# EAGLE design atxmega128d3_breakout (EAGLE 6.1)
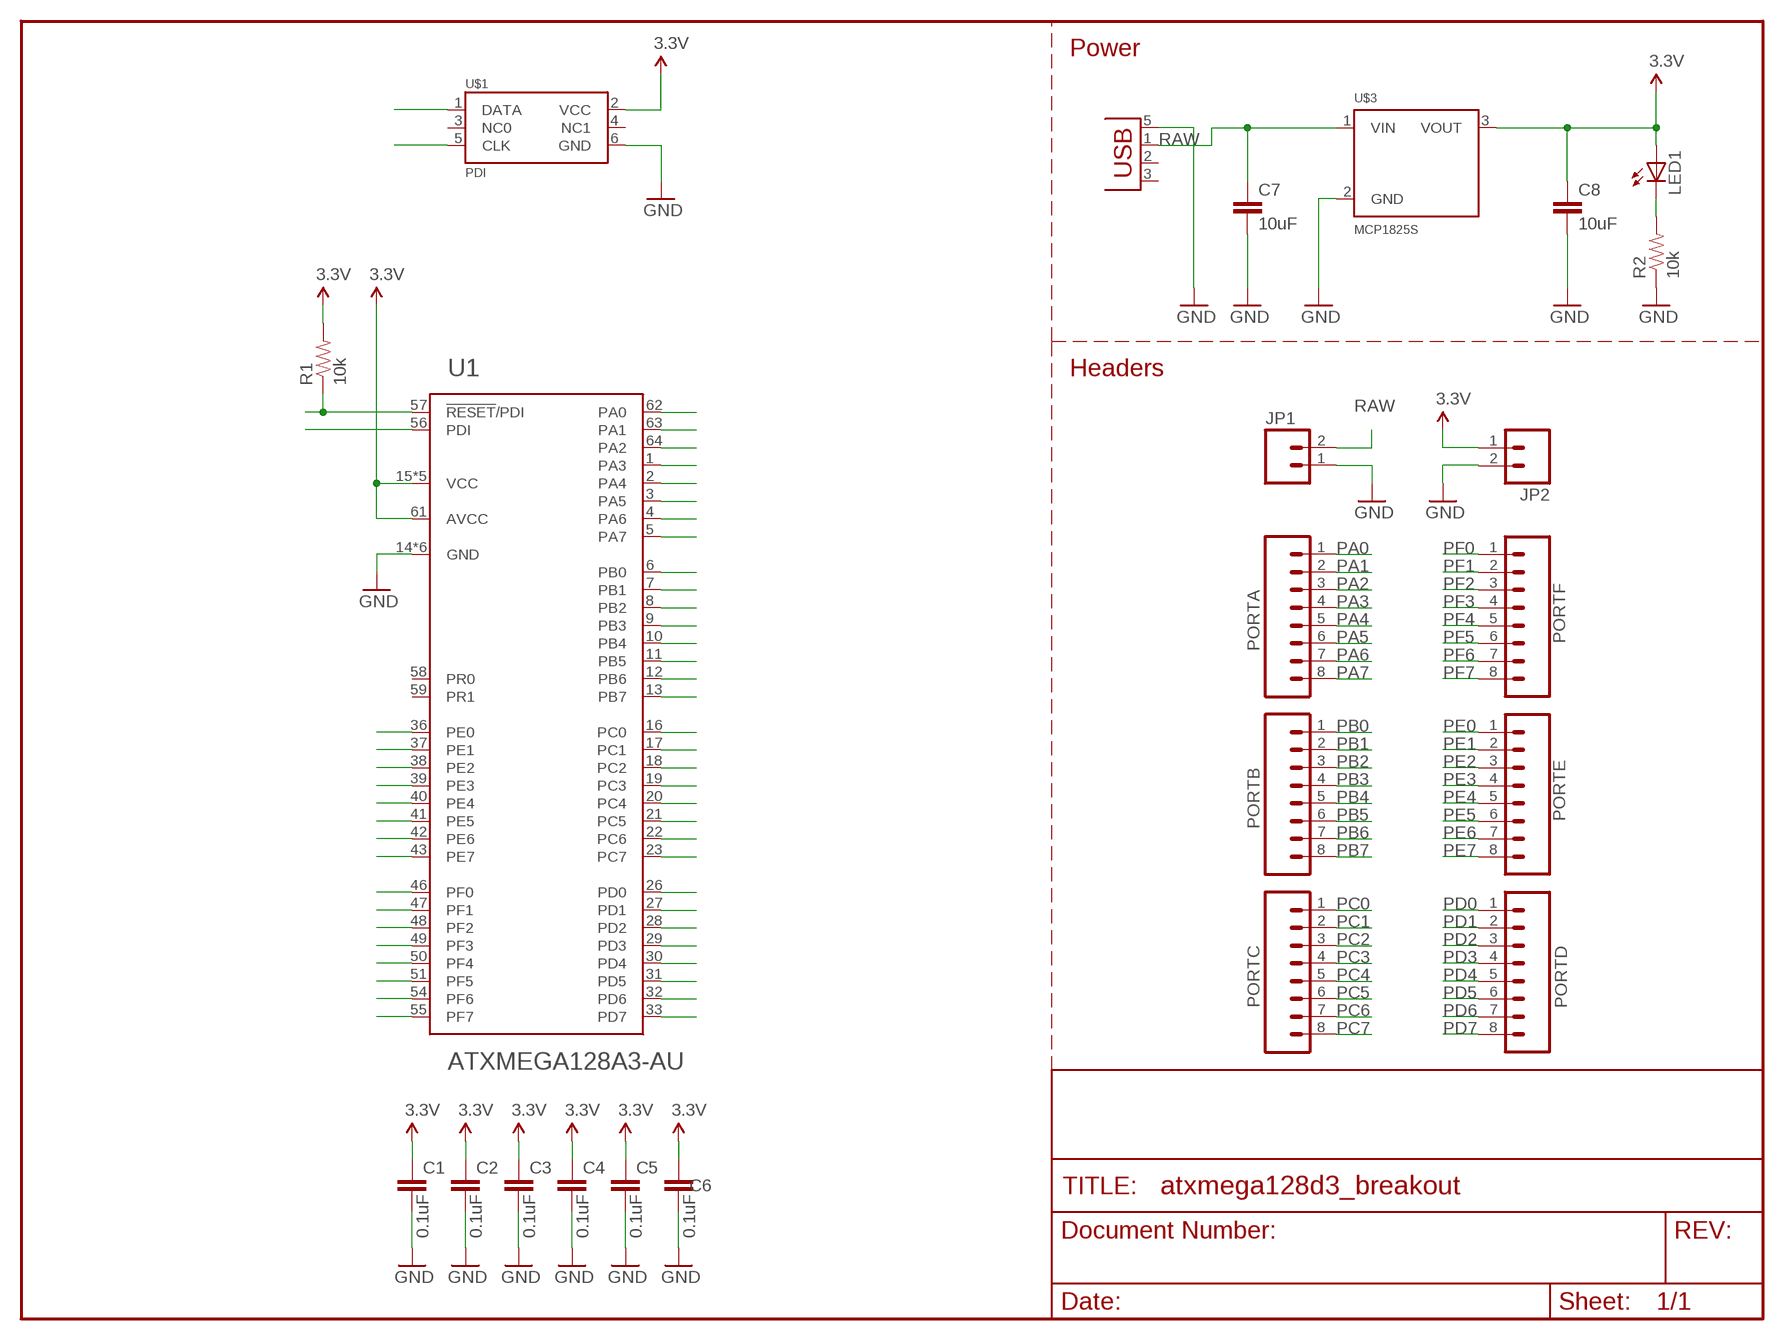
[diagram p0: schematic, sheet 1]

## Parts
C1  0.1uF  CAP0805  [0805]
C2  0.1uF  CAP0805  [0805]
C3  0.1uF  CAP0805  [0805]
C4  0.1uF  CAP0805  [0805]
C5  0.1uF  CAP0805  [0805]
C6  0.1uF  CAP0805  [0805]
C7  10uF  CAP0805  [0805]
C8  10uF  CAP0805  [0805]
JP1  M02PTH  [1X02]
JP2  M02PTH  [1X02]
LED1  LEDCHIP-LED0805  [CHIP-LED0805]
PORTA  M081X08  [1X08]
PORTB  M081X08  [1X08]
PORTC  M081X08  [1X08]
PORTD  M081X08  [1X08]
PORTE  M081X08  [1X08]
PORTF  M081X08  [1X08]
R1  10k  RESISTOR0805-RES  [0805]
R2  10k  RESISTOR0805-RES  [0805]
U1  ATXMEGA128A3-AU  [TQFP-64A-64]
U$1  PDI  [2X3]
U$2  USB  [USB_MICRO_B]
U$3  MCP1825S  [SOT233]

## Nets
3.3V: C1.1 C2.1 C3.1 C4.1 C5.1 C6.1 C8.1 JP2.1 LED1.A R1.2 U1.15(VCC) U1.25(VCC) U1.35(VCC) U1.45(VCC) U1.53(VCC) U1.61(AVCC) U$1.2(VCC) U$3.3(VOUT)
CLK: R1.1 U1.57(!RESET!/PDI) U$1.5(CLK)
DATA: U1.56(PDI) U$1.1(DATA)
GND: C1.2 C2.2 C3.2 C4.2 C5.2 C6.2 C7.2 C8.2 JP1.1 JP2.2 R2.1 U1.14(GND) U1.24(GND) U1.34(GND) U1.44(GND) U1.52(GND) U1.60(GND) U$1.6(GND) U$2.5(GND) U$3.2(GND)
N$1: LED1.C R2.2
PA0: PORTA.1 U1.62(PA0)
PA1: PORTA.2 U1.63(PA1)
PA2: PORTA.3 U1.64(PA2)
PA3: PORTA.4 U1.1(PA3)
PA4: PORTA.5 U1.2(PA4)
PA5: PORTA.6 U1.3(PA5)
PA6: PORTA.7 U1.4(PA6)
PA7: PORTA.8 U1.5(PA7)
PB0: PORTB.1 U1.6(PB0)
PB1: PORTB.2 U1.7(PB1)
PB2: PORTB.3 U1.8(PB2)
PB3: PORTB.4 U1.9(PB3)
PB4: PORTB.5 U1.10(PB4)
PB5: PORTB.6 U1.11(PB5)
PB6: PORTB.7 U1.12(PB6)
PB7: PORTB.8 U1.13(PB7)
PC0: PORTC.1 U1.16(PC0)
PC1: PORTC.2 U1.17(PC1)
PC2: PORTC.3 U1.18(PC2)
PC3: PORTC.4 U1.19(PC3)
PC4: PORTC.5 U1.20(PC4)
PC5: PORTC.6 U1.21(PC5)
PC6: PORTC.7 U1.22(PC6)
PC7: PORTC.8 U1.23(PC7)
PD0: PORTD.1 U1.26(PD0)
PD1: PORTD.2 U1.27(PD1)
PD2: PORTD.3 U1.28(PD2)
PD3: PORTD.4 U1.29(PD3)
PD4: PORTD.5 U1.30(PD4)
PD5: PORTD.6 U1.31(PD5)
PD6: PORTD.7 U1.32(PD6)
PD7: PORTD.8 U1.33(PD7)
PE0: PORTE.1 U1.36(PE0)
PE1: PORTE.2 U1.37(PE1)
PE2: PORTE.3 U1.38(PE2)
PE3: PORTE.4 U1.39(PE3)
PE4: PORTE.5 U1.40(PE4)
PE5: PORTE.6 U1.41(PE5)
PE6: PORTE.7 U1.42(PE6)
PE7: PORTE.8 U1.43(PE7)
PF0: PORTF.1 U1.46(PF0)
PF1: PORTF.2 U1.47(PF1)
PF2: PORTF.3 U1.48(PF2)
PF3: PORTF.4 U1.49(PF3)
PF4: PORTF.5 U1.50(PF4)
PF5: PORTF.6 U1.51(PF5)
PF6: PORTF.7 U1.54(PF6)
PF7: PORTF.8 U1.55(PF7)
RAW: C7.1 JP1.2 U$2.1(VBUS) U$3.1(VIN)
Unconnected: U1.58(PR0) U1.59(PR1) U$1.3(NC0) U$1.4(NC1) U$2.2(D-) U$2.3(D+)

## Notes on the sheet
- Power
- Headers

## Library data of the parts
C1-C8 = SparkFun:CAP: Capacitor Standard 0603 ceramic capacitor, and 0.1" leaded capacitor.
JP1 JP2 = SparkFun:M02: Header 2 Standard 2-pin 0.1" header. Use with straight break away headers (SKU : PRT-00116), right angle break away headers (PRT-00553), swiss pins (PRT-00743), machine pins (PRT-00117), and female headers (PRT-00115). Molex polarized connector foot print use with SKU : PRT-08233 with associated crimp pins and housings.
LED1 = led:LED: LED OSRAM: - CHIPLED LG R971, LG N971, LY N971, LG Q971, LY Q971, LO R971, LY R971 LH N974, LH R974 LS Q976, LO Q976, LY Q976 LO Q996 - Hyper CHIPLED LW Q18S LB Q993, LB Q99A, LB R99A - SideLED LS A670, LO A670, LY A670, LG A670, LP A670 LB A673, LV A673, LT A673, LW A673 LH A674 LY A675 LS A676, LA A676, LO A676, LY A676, LW A676 LS A679, LY A679, LG A679 - Hyper Micro SIDELED® LS Y876, LA Y876, LO Y876, LY Y876 LT Y87S - SmartLED LW L88C, LW L88S LB L89C, LB L89S, LG L890 LS L89K, LO L89K, LY L89K LS L896, LA L896, LO L896, LY L896 - TOPLED LS T670, LO T670, LY T670, LG T670, LP T670 LSG T670, LSP T670, LSY T670, LOP T670, LYG T670 LG T671, LOG T671, LSG T671 LB T673, LV T673, LT T673, LW T673 LH T674 LS T676, LA T676, LO T676, LY T676, LB T676, LH T676, LSB T676, LW T676 LB T67C, LV T67C, LT T67C, LS T67K, LO T67K, LY T67K, LW E67C LS E67B, LA E67B, LO E67B, LY E67B, LB E67C, LV E67C, LT E67C LW T67C LS T679, LY T679, LG T679 LS T770, LO T770, LY T770, LG T770, LP T770 LB T773, LV T773, LT T773, LW T773 LH T774 LS E675, LA E675, LY E675, LS T675 LS T776, LA T776, LO T776, LY T776, LB T776 LHGB T686 LT T68C, LB T68C - Hyper Mini TOPLED® LB M676 - Mini TOPLED Santana® LG M470 LS M47K, LO M47K, LY M47K Source: http://www.osram.convergy.de LUXEON: - LUMILED® LXK2-PW12-R00, LXK2-PW12-S00, LXK2-PW14-U00, LXK2-PW14-V00 LXK2-PM12-R00, LXK2-PM12-S00, LXK2-PM14-U00 LXK2-PE12-Q00, LXK2-PE12-R00, LXK2-PE12-S00, LXK2-PE14-T00, LXK2-PE14-U00 LXK2-PB12-K00, LXK2-PB12-L00, LXK2-PB12-M00, LXK2-PB14-N00, LXK2-PB14-P00, LXK2-PB14-Q00 LXK2-PR12-L00, LXK2-PR12-M00, LXK2-PR14-Q00, LXK2-PR14-R00 LXK2-PD12-Q00, LXK2-PD12-R00, LXK2-PD12-S00 LXK2-PH12-R00, LXK2-PH12-S00 LXK2-PL12-P00, LXK2-PL12-Q00, LXK2-PL12-R00 Source: www.luxeon.com KINGBRIGHT: KA-3528ASYC Source: www.kingbright.com
PORTA PORTB PORTC PORTD PORTE PORTF = SparkFun:M08: Header 8 Standard 8-pin 0.1" header. Use with straight break away headers (SKU : PRT-00116), right angle break away headers (PRT-00553), swiss pins (PRT-00743), machine pins (PRT-00117), and female headers (PRT-00115).
R1 R2 = SparkFun:RESISTOR: Resistor Basic schematic elements and footprints for 0603, 1206, and PTH resistors.
U1 = atmel-xmega:ATXMEGA128A3: 8/16-bit XMEGA A3 Microcontroller Features High-performance, Low-power 8/16-bit Atmel® AVR® XMEGATM Microcontroller Non-volatile Program and Data Memories – 64 KB - 256 KB of In-System Self-Programmable Flash – 4 KB - 8 KB Boot Code Section with Independent Lock Bits – 2 KB - 4 KB EEPROM – 4 KB - 16 KB Internal SRAM Peripheral Features – Four-channel DMA Controller with support for external requests – Eight-channel Event System – Seven 16-bit Timer/Counters Four Timer/Counters with 4 Output Compare or Input Capture channels Three Timer/Counters with 2 Output Compare or Input Capture channels High Resolution Extensions on all Timer/Counters Advanced Waveform Extension on one Timer/Counter – Seven USARTs IrDA Extension on 1 USART – AES and DES Crypto Engine – Two Two-wire Interfaces with dual address match (I2C and SMBus compatible) – Three SPI (Serial Peripheral Interfaces) – 16-bit Real Time Counter with Separate Oscillator – Two Eight-channel, 12-bit, 2 Msps Analog to Digital Converters – One Two-channel, 12-bit, 1 Msps Digital to Analog Converter – Four Analog Comparators with Window compare function – External Interrupts on all General Purpose I/O pins – Programmable Watchdog Timer with Separate On-chip Ultra Low Power Oscillator Special Microcontroller Features – Power-on Reset and Programmable Brown-out Detection – Internal and External Clock Options with PLL – Programmable Multi-level Interrupt Controller – Sleep Modes: Idle, Power-down, Standby, Power-save, Extended Standby – Advanced Programming, Test and Debugging Interfaces JTAG (IEEE 1149.1 Compliant) Interface for test, debug and programming PDI (Program and Debug Interface) for programming, test and debugging I/O and Packages – 50 Programmable I/O Lines – 64-lead TQFP – 64-pad QFN Operating Voltage – 1.6 – 3.6V Speed performance – 0 – 12 MHz @ 1.6 – 3.6V – 0 – 32 MHz @ 2.7 – 3.6V
U$1 = rocket:PDI
U$2 = rocket:USB
U$3 = rocket:MCP1825S

## Board
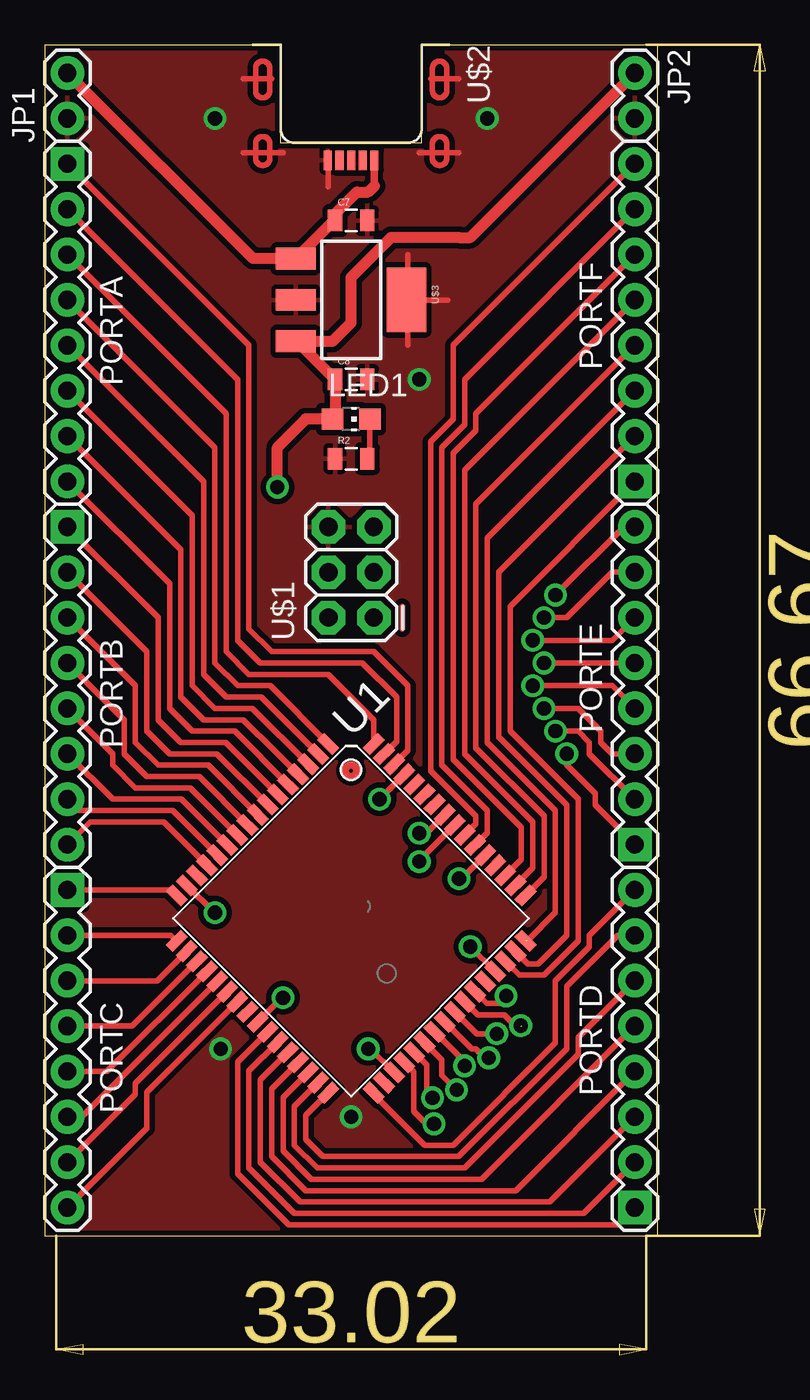
[diagram p1: board, top side]
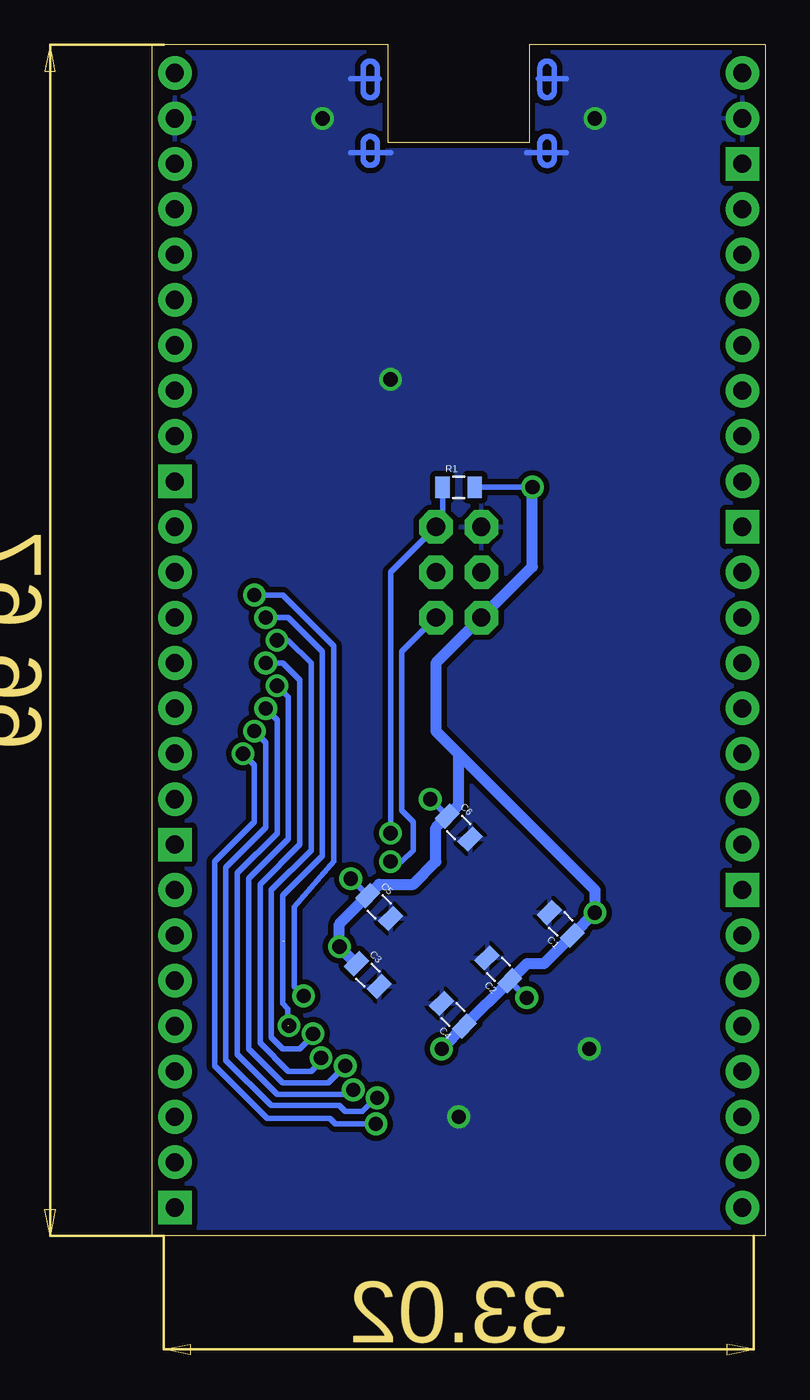
[diagram p2: board, bottom side, seen from below]

Size 34.29 x 66.67 mm. Coordinates in mm from the lower left corner, seen from the top.
Outline: 0,0 34.29,0 34.29,66.67 21.09,66.67 21.09,61.19 13.18,61.19 13.18,66.67 0,66.67 0,0
Copper layers (1*16): Top 0.035mm / dielectric 1.5mm / Bottom 0.035mm
Design rules "default": minimum track width 10mil, minimum drill 24mil, track to track 8mil, track to pad 8mil, pad to pad 8mil, via to via 8mil, smd to smd 8mil, copper to edge 8mil, drill to drill 8mil, minimum pad ring 10mil, minimum via ring 8mil, stop-mask expansion 4mil, vias tented up to drill 0mil, thermal gap 10mil
tRestrict: area 16.5,45.1 to 17.8,46.4

### Footprints (pad centres in the part's own frame; a part is rotated, then mirrored left to right if it is on the bottom)
0805 = smd 0.8 x 1.2: 1 -0.9,0; 2 0.9,0
1X02 = drill 1.016 pad 1.88: 1 0,0; 2 2.54,0
CHIP-LED0805 = smd 1.2 x 1.2: A 0,-1.05; C 0,1.05
1X08 = drill 1.016 pad 1.88 square: 1 0,0 | drill 1.016 pad 1.88: 2 2.54,0; 3 5.08,0; 4 7.62,0; 5 10.16,0; 6 12.7,0; 7 15.24,0; 8 17.78,0
TQFP-64A-64 = smd 1.194 x 0.559: 1 -7.8,6; 2 -7.8,5.2; 3 -7.8,4.4; 4 -7.8,3.6; 5 -7.8,2.8; 6 -7.8,2; 7 -7.8,1.2; 8 -7.8,0.4; 9 -7.8,-0.4; 10 -7.8,-1.2; 11 -7.8,-2; 12 -7.8,-2.8; 13 -7.8,-3.6; 14 -7.8,-4.4; 15 -7.8,-5.2; 16 -7.8,-6; 33 7.8,-6; 34 7.8,-5.2; 35 7.8,-4.4; 36 7.8,-3.6; 37 7.8,-2.8; 38 7.8,-2; 39 7.8,-1.2; 40 7.8,-0.4; 41 7.8,0.4; 42 7.8,1.2; 43 7.8,2; 44 7.8,2.8; 45 7.8,3.6; 46 7.8,4.4; 47 7.8,5.2; 48 7.8,6 | smd 0.559 x 1.194: 17 -6,-7.8; 18 -5.2,-7.8; 19 -4.4,-7.8; 20 -3.6,-7.8; 21 -2.8,-7.8; 22 -2,-7.8; 23 -1.2,-7.8; 24 -0.4,-7.8; 25 0.4,-7.8; 26 1.2,-7.8; 27 2,-7.8; 28 2.8,-7.8; 29 3.6,-7.8; 30 4.4,-7.8; 31 5.2,-7.8; 32 6,-7.8; 49 6,7.8; 50 5.2,7.8; 51 4.4,7.8; 52 3.6,7.8; 53 2.8,7.8; 54 2,7.8; 55 1.2,7.8; 56 0.4,7.8; 57 -0.4,7.8; 58 -1.2,7.8; 59 -2,7.8; 60 -2.8,7.8; 61 -3.6,7.8; 62 -4.4,7.8; 63 -5.2,7.8; 64 -6,7.8
2X3 = drill 1.016 pad 1.88 octagon: 1 -2.54,-1.27; 2 -2.54,1.27; 3 0,-1.27; 4 0,1.27; 5 2.54,-1.27; 6 2.54,1.27
USB_MICRO_B = smd 1.1 x 0.45: 1 6.47,1.3; 2 6.47,0.65; 3 6.47,0; 4 6.47,-0.65; 5 6.47,-1.3
SOT233 = smd 1.219 x 2.235: 1 -2.311,-3.099; 2 0,-3.099; 3 2.311,-3.099 | smd 3.6 x 2.2: 4 0,3.099

### Placement (x,y rotation side)
C1  11.43,17.46 135 bottom
C2  14.92,14.92 135 bottom
C3  22.23,14.61 315 bottom
C4  17.46,12.38 135 bottom
C5  21.59,18.41 315 bottom
C6  17.14,22.86 315 bottom
C7  17.14,56.83 0 top
C8  17.14,47.94 0 top
JP1  1.27,62.55 90 top
JP2  33.02,65.09 270 top
LED1  17.14,45.72 270 top
PORTA  1.27,60.01 270 top
PORTB  1.27,39.69 270 top
PORTC  1.27,19.37 270 top
PORTD  33.02,1.59 90 top
PORTE  33.02,21.91 90 top
PORTF  33.02,42.23 90 top
R1  17.14,41.91 0 bottom
R2  17.14,43.5 0 top
U1  17.14,17.78 315 top
U$1  17.14,37.15 90 top
U$2  17.14,66.67 270 top
U$3  17.14,52.39 270 top

### Tracks (layer width: path | path; a pad name or v marks a point on that pad's centre or on a via)
3.3V  (via drill 0.79 pad 1.27)
  Top 0.305: U1.61 v18.73,24.45 | v23.18,20 23.33,20 U1.53 | U1.45 25.2,14.81 v23.81,16.19 | v18.1,10.48 18.23,10.48 U1.35 | v13.34,13.34 13.27,13.34 U1.25 | v9.53,18.1 9.47,18.1 U1.15
  Top 0.61: 14.11,50.08 C8.1 16.25,45.87 LED1.A 14.61,45.72 13.02,44.13 v13.02,41.91 | 14.11,50.08 U$3.3 | 14.11,50.08 16.1,50.08 17.14,51.12 17.14,53.66 19.37,55.88 23.18,55.88 23.81,55.88 JP2.1
  Bottom 0.305: C1.1 | C2.1 v13.34,13.34 | v13.34,13.34 | v18.09,10.48 v18.1,10.48 | C5.1 v23.18,20 | R1.2 v13.02,41.91 | C6.1 v18.73,24.45
  Bottom 0.61: 17.14,26.99 18.41,28.26 18.41,32.07 U$1.2 13.02,37.47 v13.02,41.91 | 17.14,26.99 9.53,19.37 v9.53,18.1 C1.1 | 17.14,26.99 17.14,24.13 C6.1 18.41,22.86 18.41,20.95 19.68,19.68 21.59,19.68 C5.1 23.81,17.46 v23.81,16.19 C3.1 | C1.1 12.38,15.24 13.34,15.24 C2.1 | C2.1 C4.1 v18.09,10.48
CLK  (via drill 0.79 pad 1.27)
  Top 0.305: U1.57 21.34,22.54 v20.95,22.54
  Bottom 0.305: v20.95,22.54 20.95,37.15 U$1.5 18.05,40.06 R1.1
DATA  (via drill 0.79 pad 1.27)
  Top 0.305: v20.95,20.95 20.95,21.02 U1.56
  Bottom 0.305: U$1.1 20.32,32.7 20.32,23.81 19.68,23.18 19.68,21.59 20.32,20.95 v20.95,20.95
GND  (via drill 0.79 pad 1.27)
  Top 0.305: 11.11,64.77 12.7,64.77 | 11.11,60.64 13.34,60.64 | 20.95,60.64 23.18,60.64 | 21.59,64.77 23.18,64.77 | 15.88,60.64 15.88,58.74 | 20.32,52.39 22.54,52.39 | 20.32,49.85 20.32,54.93
  Bottom 0.305: 11.11,64.77 12.7,64.77 | 11.11,60.64 13.34,60.64 | 20.95,60.64 23.18,60.64 | 21.59,64.77 23.18,64.77
  other vias: 20.95,47.94 24.77,62.55 9.53,62.55 17.14,6.67 9.84,10.48
  pour Bottom (isolate 0.305): 0,0 34.29,0 34.29,66.67 0,66.67
  pour Top (isolate 0.305): 0,0 34.29,0 34.29,66.67 0,66.67
N$1
  Top 0.305: LED1.C 18.2,43.65 R2.2
N$2
  Top 0.305: 20,35.24 20,33.97
PA0
  Top 0.305: PORTA.1 11.43,49.85 11.43,33.97 12.7,32.7 18.41,32.7 20.32,30.8 20.32,27.18 U1.62
PA1
  Top 0.305: PORTA.2 10.79,47.94 10.79,33.34 12.06,32.07 17.78,32.07 19.68,30.16 19.68,27.67 U1.63
PA2
  Top 0.305: PORTA.3 10.16,46.04 10.16,32.7 11.43,31.43 15.88,31.43 18.42,28.89 U1.64
PA3
  Top 0.305: PORTA.4 9.53,44.13 9.53,32.07 10.79,30.8 12.61,30.8 U1.1
PA4
  Top 0.305: PORTA.5 8.89,42.23 8.89,31.43 10.16,30.16 12.12,30.16 U1.2
PA5
  Top 0.305: PORTA.6 8.26,40.32 8.26,30.8 9.53,29.53 11.62,29.53 U1.3
PA6
  Top 0.305: U1.4 12.89,27.11 11.11,28.89 8.89,28.89 7.62,30.16 7.62,38.42 PORTA.7
PA7
  Top 0.305: PORTA.8 6.99,36.51 6.99,29.53 8.26,28.26 10.63,28.26 U1.5
PB0
  Top 0.305: PORTB.1 6.35,34.61 6.35,28.89 7.62,27.62 10.13,27.62 U1.6
PB1
  Top 0.305: U1.7 9.63,26.99 6.99,26.99 5.71,28.26 5.71,32.7 PORTB.2
PB2
  Top 0.305: U1.8 9.14,26.35 6.35,26.35 5.08,27.62 5.08,30.8 PORTB.3
PB3
  Top 0.305: U1.9 8.64,25.72 5.71,25.72 4.45,26.99 4.45,28.89 PORTB.4
PB4
  Top 0.305: U1.10 8.14,25.08 5.08,25.08 3.81,26.35 3.81,26.99 PORTB.5
PB5
  Top 0.305: U1.11 7.65,24.45 3.81,24.45 PORTB.6
PB6
  Top 0.305: U1.12 7.15,23.81 1.91,23.81 PORTB.7
PB7
  Top 0.305: U1.13 6.66,23.18 2.54,23.18 PORTB.8
PC0
  Top 0.305: PORTC.1 7.07,19.37 U1.16
PC1
  Top 0.305: PORTC.2 7.07,16.83 U1.17
PC2
  Top 0.305: PORTC.3 6.3,14.29 U1.18
PC3
  Top 0.305: U1.19 4.89,11.75 PORTC.4
PC4
  Top 0.305: U1.20 3.48,9.21 PORTC.5
PC5
  Top 0.305: U1.21 2.07,6.67 PORTC.6
PC6
  Top 0.305: U1.22 5.08,8.54 5.08,7.94 PORTC.7
PC7
  Top 0.305: U1.23 5.71,8.05 5.71,6.03 PORTC.8
PD0
  Top 0.305: U1.26 10.79,9.73 10.79,3.49 13.65,0.64 32.07,0.64 PORTD.1
PD1
  Top 0.305: U1.27 11.43,9.24 11.43,3.81 13.97,1.27 30.16,1.27 PORTD.2
PD2
  Top 0.305: U1.28 12.06,8.74 12.06,4.13 14.29,1.91 28.26,1.91 PORTD.3
PD3
  Top 0.305: U1.29 12.7,8.24 12.7,4.45 14.61,2.54 26.35,2.54 PORTD.4
PD4
  Top 0.305: U1.30 13.34,7.75 13.34,4.76 14.92,3.17 24.45,3.17 PORTD.5
PD5
  Top 0.305: U1.31 13.97,7.25 13.97,5.08 15.24,3.81 23.5,3.81 29.84,10.16 29.84,11.11 PORTD.6
PD6
  Top 0.305: U1.32 14.61,6.75 14.61,5.4 15.56,4.45 23.18,4.45 29.21,10.48 29.21,13.97 32.07,16.83 PORTD.7
PD7
  Top 0.305: PORTD.8 30.48,16.83 30.48,16.19 28.57,14.29 28.57,10.79 22.86,5.08 21.27,5.08 18.42,7.93 U1.33
PE0  (via drill 0.79 pad 1.27)
  Top 0.305: PORTE.1 30.8,24.13 30.8,24.77 29.21,26.35 v29.21,26.99 | U1.36 20.64,9.2 20.64,6.99 21.35,6.27 v21.78,6.27
  Bottom 0.305: v29.21,26.99 28.57,26.35 28.57,23.18 30.8,20.95 30.8,9.53 27.86,6.59 24.37,6.59 24.05,6.27 v21.78,6.27
PE1  (via drill 0.79 pad 1.27)
  Top 0.305: PORTE.2 30.48,26.99 30.48,27.62 29.84,28.26 v28.57,28.26 | U1.37 21.38,9.58 21.38,8.05 v21.7,7.73
  Bottom 0.305: v21.7,7.73 21.8,7.73 22.54,6.99 23.5,6.99 23.81,7.3 27.62,7.3 30.16,9.84 30.16,20.64 27.94,22.86 27.94,27.62 v28.57,28.26
PE2  (via drill 0.79 pad 1.27)
  Top 0.305: PORTE.3 31.75,26.99 31.11,27.62 31.11,28.26 29.84,29.53 v27.94,29.53 | U1.38 22.23,9.87 22.23,9 v23.05,8.18
  Bottom 0.305: v27.94,29.53 27.3,28.89 27.3,22.54 29.53,20.32 29.53,10.16 27.3,7.94 23.29,7.94 v23.05,8.18
PE3  (via drill 0.79 pad 1.27)
  Top 0.305: PORTE.4 31.75,30.8 v27.3,30.8 | v23.5,9.53 23.5,9.73 U1.39
  Bottom 0.305: v23.5,9.53 24.45,8.57 26.99,8.57 28.89,10.48 28.89,20 26.67,22.23 26.67,30.16 v27.3,30.8
PE4  (via drill 0.79 pad 1.27)
  Top 0.305: U1.40 23.88,10.48 24.13,10.48 24.63,9.97 v24.84,9.97 | v27.94,32.07 PORTE.5
  Bottom 0.305: v24.84,9.97 24.84,9.77 25.4,9.21 26.67,9.21 28.26,10.79 28.26,19.68 26.04,21.91 26.04,31.11 26.99,32.07 v27.94,32.07
PE5  (via drill 0.79 pad 1.27)
  Top 0.305: v27.3,33.34 31.75,33.34 PORTE.6 | U1.41 24.17,11.32 v25.29,11.32
  Bottom 0.305: v25.29,11.32 25.29,11.22 26.04,10.48 26.99,10.48 27.62,11.11 27.62,19.37 25.4,21.59 25.4,32.07 26.67,33.34 v27.3,33.34
PE6  (via drill 0.79 pad 1.27)  (1 unrouted)
  Top 0.305: PORTE.7 31.75,37.15 29.21,34.61 v27.94,34.61 | U1.42 24.24,12.38 25.72,12.38 26.33,11.77 v26.64,11.77
  Bottom 0.305: v27.94,34.61 26.67,34.61 24.77,32.7 24.77,21.27 26.99,19.05 26.99,13.02 26.69,12.72 26.69,11.77
PE7  (via drill 0.79 pad 1.27)
  Top 0.305: U1.43 24.74,13.02 25.4,13.02 v25.82,13.44 | PORTE.8 32.38,39.69 v28.57,35.88
  Bottom 0.305: v28.57,35.88 26.99,35.88 24.13,33.02 24.13,20.95 26.35,18.41 26.35,13.97 v25.82,13.44
PF0
  Top 0.305: PORTF.1 26.04,35.24 26.04,28.26 29.84,24.45 29.84,16.51 27.94,14.61 26.54,14.61 U1.46
PF1
  Top 0.305: PORTF.2 25.4,37.15 25.4,27.94 29.21,24.13 29.21,16.83 27.62,15.24 27.04,15.24 U1.47
PF2  (1 unrouted)
  Top 0.305: PORTF.3 24.77,39.05 24.77,27.62 28.57,23.81 28.57,18.1 26.99,16.51
PF3
  Top 0.305: PORTF.4 24.13,40.96 24.13,27.3 27.94,23.5 27.94,20.09 U1.49
PF4
  Top 0.305: PORTF.5 23.5,42.86 23.5,26.99 27.3,23.18 27.3,20.59 U1.50
PF5
  Top 0.305: PORTF.6 24.13,46.04 24.13,45.09 22.86,43.81 22.86,26.67 26.67,22.86 26.67,21.08 U1.51
PF6
  Top 0.305: PORTF.7 23.5,47.94 23.5,45.4 22.23,44.13 22.23,26.35 24.77,23.81 24.77,22.57 U1.54
PF7
  Top 0.305: PORTF.8 22.86,49.85 22.86,45.72 21.59,44.45 21.59,26.04 24.13,23.5 24.13,23.07 U1.55
RAW
  Top 0.406: C7.1 16.25,57.2 | 18.45,58.77 U$2.1
  Top 0.61: C7.1 16.18,56.83 U$3.1 12.29,54.7 11.66,54.7 JP1.2 | 16.25,57.2 17.46,58.42 18.1,58.42 18.45,58.77
(copper drawn outside any net)
  shapes: Top circle x1